# Altium schematic sheet power_rails.SchDoc: Power rails
size A4; SheetNumber: 7; SheetTotal: 20; TitleBig: Power rails; Desc_line1: Battery DC/DC step-down converter and Vbias for signal conditioning circuit. 3V3 is the main system power and can; Desc_line2: deliver upto 2 amps. VBIAS is only for polarization of the probes and won't drag much current.
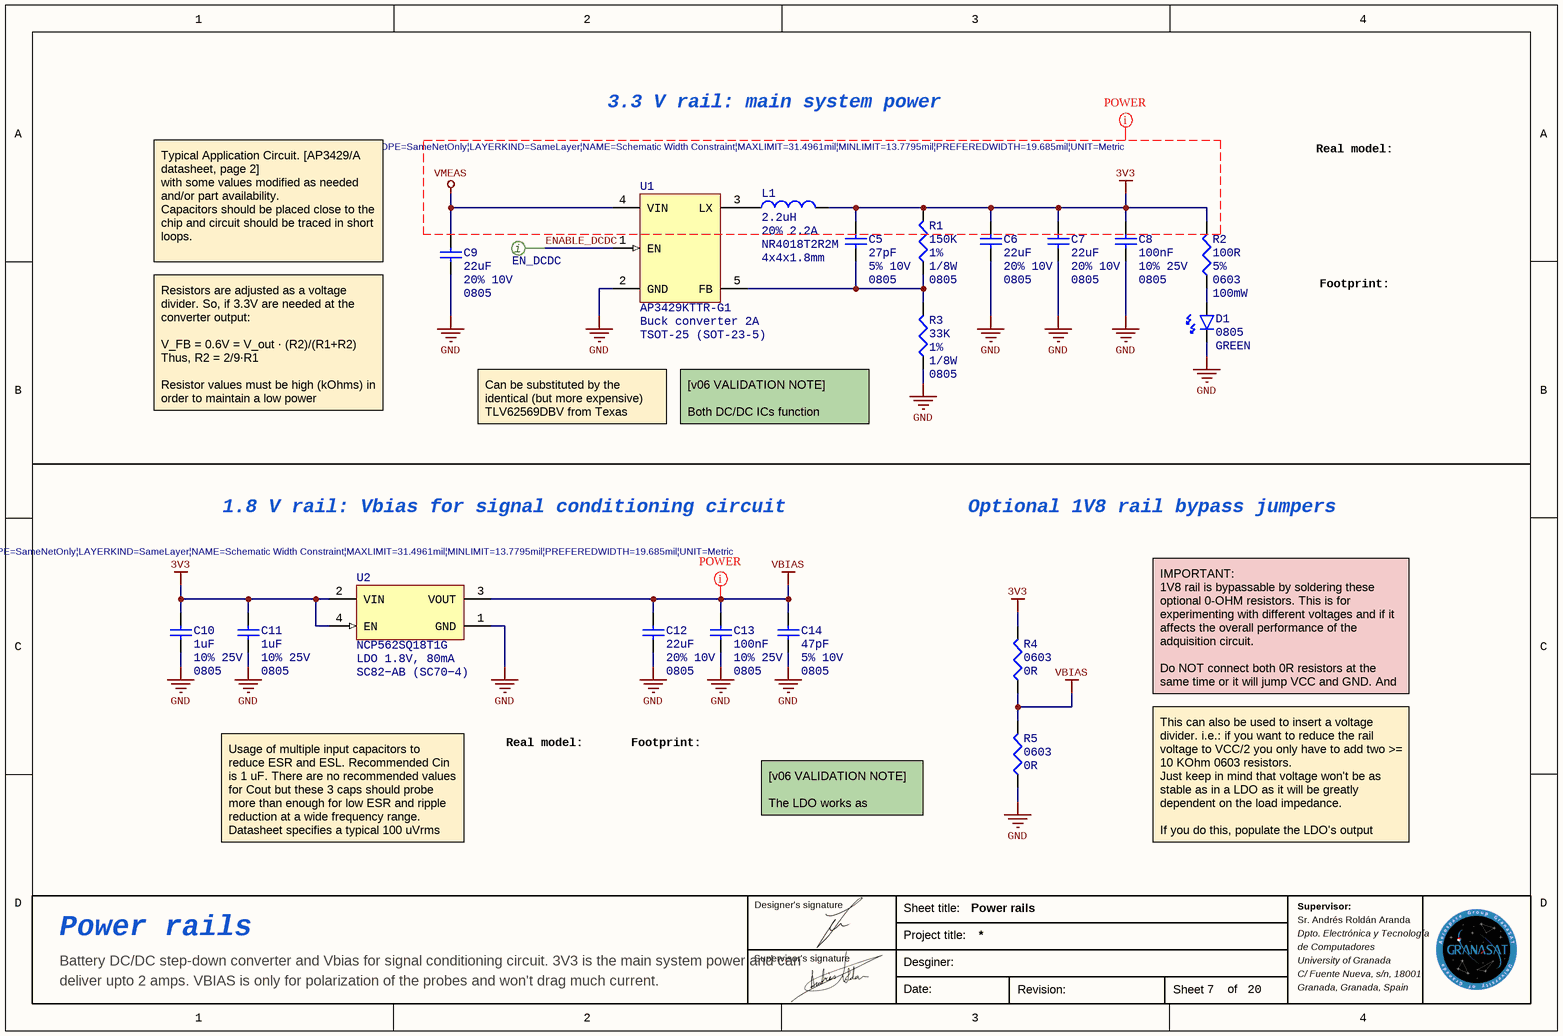
[diagram p0: power_rails.SchDoc]

## Parts
C5  value 27pF  Tolerance: 5% 10V  PackageDescription: 0805  [CAP 0805_2012]  (hidden comment: Cap_cer_0805)
C6  value 22uF  Tolerance: 20% 10V  PackageDescription: 0805  [CAP 0805_2012]  (hidden comment: Cap_cer_0805)
C7  value 22uF  Tolerance: 20% 10V  PackageDescription: 0805  [CAP 0805_2012]  (hidden comment: Cap_cer_0805)
C8  value 100nF  Tolerance: 10% 25V  PackageDescription: 0805  [CAP 0805_2012]  (hidden comment: Cap_cer_0805)
C9  value 22uF  Tolerance: 20% 10V  PackageDescription: 0805  [CAP 0805_2012]  (hidden comment: Cap_cer_0805)
C10  value 1uF  Tolerance: 10% 25V  PackageDescription: 0805  [CAP 0805_2012]  (hidden comment: Cap_cer_0805)
C11  value 1uF  Tolerance: 10% 25V  PackageDescription: 0805  [CAP 0805_2012]  (hidden comment: Cap_cer_0805)
C12  value 22uF  Tolerance: 20% 10V  PackageDescription: 0805  [CAP 0805_2012]  (hidden comment: Cap_cer_0805)
C13  value 100nF  Tolerance: 10% 25V  PackageDescription: 0805  [CAP 0805_2012]  (hidden comment: Cap_cer_0805)
C14  value 47pF  Tolerance: 5% 10V  PackageDescription: 0805  [CAP 0805_2012]  (hidden comment: Cap_cer_0805)
D1  PackageDescription: 0805  Type: GREEN  [LED 0805_2012 GREEN]  (hidden comment: Diode LED_G_0805)
EN_DCDC  Test Point Pad dual sided  [TEST POINT PAD]  (value not drawn)  (no BOM)
L1  value 2.2uH  Tolerance: 20% 2.2A  Part: NR4018T2R2M  PackageDescription: 4x4x1.8mm  [Inductor 4x4mm]  (hidden comment: Ind 2uH_Wire_Shield_2A_4x4)
R1  value 150K  Tolerance: 1%  PowerDisipated: 1/8W  PackageDescription: 0805  [RES 0805_2012]  (hidden comment: Res_0805_150K_1%_1/8W)
R2  value 100R  Tolerance: 5%  PackageDescription: 0603  PowerDisipated: 100mW  [RES 0603_1608]  (hidden comment: Res_0603_100R_5%_100mW)
R3  value 33K  Tolerance: 1%  PowerDisipated: 1/8W  PackageDescription: 0805  [RES 0805_2012]  (hidden comment: Res_0805_33K_1%_1/8W)
R4  value 0R  PackageDescription: 0603  [RES 0603_1608]  (hidden comment: Res_0603_0ohm)
R5  value 0R  PackageDescription: 0603  [RES 0603_1608]  (hidden comment: Res_0603_0ohm)
U1  Part: AP3429KTTR-G1  Type: Buck converter 2A  PackageDescription: TSOT-25 (SOT-23-5)  [SOT-23-5 AP3429]  (hidden comment: AP3429_A)
U2  value LDO 1.8V, 80mA  Part: NCP562SQ18T1G  PackageDescription: SC82−AB (SC70−4)  [SC70-5 LT SC82-AB NCP562]  (hidden comment: IC NCP562SQ18T1G LDO)

## Nets
3V3: C5.2 C6.2 C7.2 C8.2 C10.2 C11.2 L1.2 R1.2 R2.2 R4.2 U2.2(VIN) U2.4(EN)
GND: C6.1 C7.1 C8.1 C9.1 C10.1 C11.1 C12.1 C13.1 C14.1 D1.2 R3.1 R5.1 U1.2(GND) U2.1(GND)
VBIAS: C12.2 C13.2 C14.2 R4.1 R5.2 U2.3(VOUT)
VMEAS: C9.2 U1.4(VIN)
ENABLE_DCDC: EN_DCDC.1 U1.1(EN)
NetC5_1: C5.1 R1.1 R3.2 U1.5(FB)
NetD1_1: D1.1 R2.1
NetL1_1: L1.1 U1.3(LX)

## Layout directives
net class POWER; rule Width Constraint [Pref Width = 0.5mm    Min Width = 0.35mm    Max Width = 0.8mm]: 3V3, VBIAS, VMEAS

## Notes on the sheet
- 3.3 V rail: main system power
- Real model:
- Typical Application Circuit. [AP3429/A datasheet, page 2]
  with some values modified as needed and/or part availability.
  Capacitors should be placed close to the chip and circuit should be traced in short loops.
  Feedback voltage V_FB is regulated at 0.6 V.
- Footprint:
- Resistors are adjusted as a voltage divider. So, if 3.3V are needed at the converter output:
  V_FB = 0.6V = V_out · (R2)/(R1+R2)
  Thus, R2 = 2/9·R1
  Resistor values must be high (kOhms) in order to maintain a low power consumption on the feedback circuit.
- Can be substituted by the identical (but more expensive) TLV62569DBV from Texas Instruments
- [v06 VALIDATION NOTE]
  Both DC/DC ICs function properly.
- 1.8 V rail: Vbias for signal conditioning circuit
- Optional 1V8 rail bypass jumpers
- IMPORTANT:
  1V8 rail is bypassable by soldering these optional 0-OHM resistors. This is for experimenting with different voltages and if it affects the overall performance of the adquisition circuit.
  Do NOT connect both 0R resistors at the same time or it will jump VCC and GND. And keep the LDO disabled at all times.
- Usage of multiple input capacitors to reduce ESR and ESL. Recommended Cin is 1 uF. There are no recommended values for Cout but these 3 caps should probe more than enough for low ESR and ripple reduction at a wide frequency range.
  Datasheet specifies a typical 100 uVrms noise on Vout, somewhat high.
- [v06 VALIDATION NOTE]
  The LDO works as expected.
- This can also be used to insert a voltage divider. i.e.: if you want to reduce the rail voltage to VCC/2 you only have to add two >= 10 KOhm 0603 resistors.
  Just keep in mind that voltage won't be as stable as in a LDO as it will be greatly dependent on the load impedance.
  If you do this, populate the LDO's output caps, so VBIAS it behaves as a small-signal GND.
- Designer's signature
- Sheet title:
- Sr. Andrés Roldán Aranda
- Supervisor:
- Supervisor's signature
- Project title:
- Desginer:
- Dpto. Electrónica y Tecnología
- de Computadores
- University of Granada
- C/ Fuente Nueva, s/n, 18001
- Granada, Granada, Spain
- Date:
- Revision:
- Sheet
- of
- (in symbol Test Point Pad dual sided) i

## Library data of the parts
C5 = Cap_cer_0805_27pF_5%: Ceramic cap size 0805; FabGroup: DCDC converter; FabOrder: 2
C6 C7 C9 = Cap_cer_0805_22uF_20%: Ceramic cap size 0805 CC0805MKX5R6BB226 Yageo MLCC 22uF 10V 20% X5R; FabGroup: DCDC converter; FabOrder: 2
C8 = Cap_cer_0805_100nF_10%: Ceramic cap size 0805; FabGroup: DCDC converter; FabOrder: 2
C10 C11 = Cap_cer_0805_1uF_10%: Ceramic cap size 0805; FabGroup: LDO Regulator & LDO bypass; FabOrder: 12
C12 = Cap_cer_0805_22uF_20%: Ceramic cap size 0805 CC0805MKX5R6BB226 Yageo MLCC 22uF 10V 20% X5R; FabGroup: LDO Regulator & LDO bypass; FabOrder: 12
C13 = Cap_cer_0805_100nF_10%: Ceramic cap size 0805; FabGroup: LDO Regulator & LDO bypass; FabOrder: 12
C14 = Cap_cer_0805_47pF_5%: Ceramic cap size 0805; FabGroup: LDO Regulator & LDO bypass; FabOrder: 12
D1 = Diode LED_G_0805: Low power LED color Green; FabGroup: DCDC converter; FabOrder: 2
EN_DCDC = Test Point Pad dual sided: Test point - PCB Pad dual sided
L1 = Ind 2uH_Wire_Shield_2A_4x4: Shielded Power Inductor 2.2 uH 20% 2.2 A 50.4 mohms 3.11 A (sat) 60MHz / 4018: 4x4x1.8mm; FabGroup: DCDC converter; FabOrder: 2
R1 = Res_0805_150K_1%_1/8W: Res size 0805 SMD mounting, low power / Yageo-RC0805FR-07150KL
R2 = Res_0603_100R_5%_100mW: Res size 0603 SMD mounting, low power
R3 = Res_0805_33K_1%_1/8W: Res size 0805 SMD mounting, low power
R4 R5 = Res_0603_0ohm: Res size 0603 SMD mounting, zero-ohm 0R Yageo RC0603JR-070RL; Tolerance: 5%; PowerDisipated: 100mW; FabGroup: LDO Regulator & LDO bypass; FabOrder: 12
U1 = IC AP3429_A dcdc buck: 1.0MHZ, 2A STEP-DOWN DC-DC BUCK CONVERTER, with latch-off protection
U2 = IC NCP562SQ18T1G LDO: Fixed output lowdropout linear regulator. / 1.8 V 80 mA; Type: LDO